# Altium project Ikea Environmental Sensor.PrjPcb
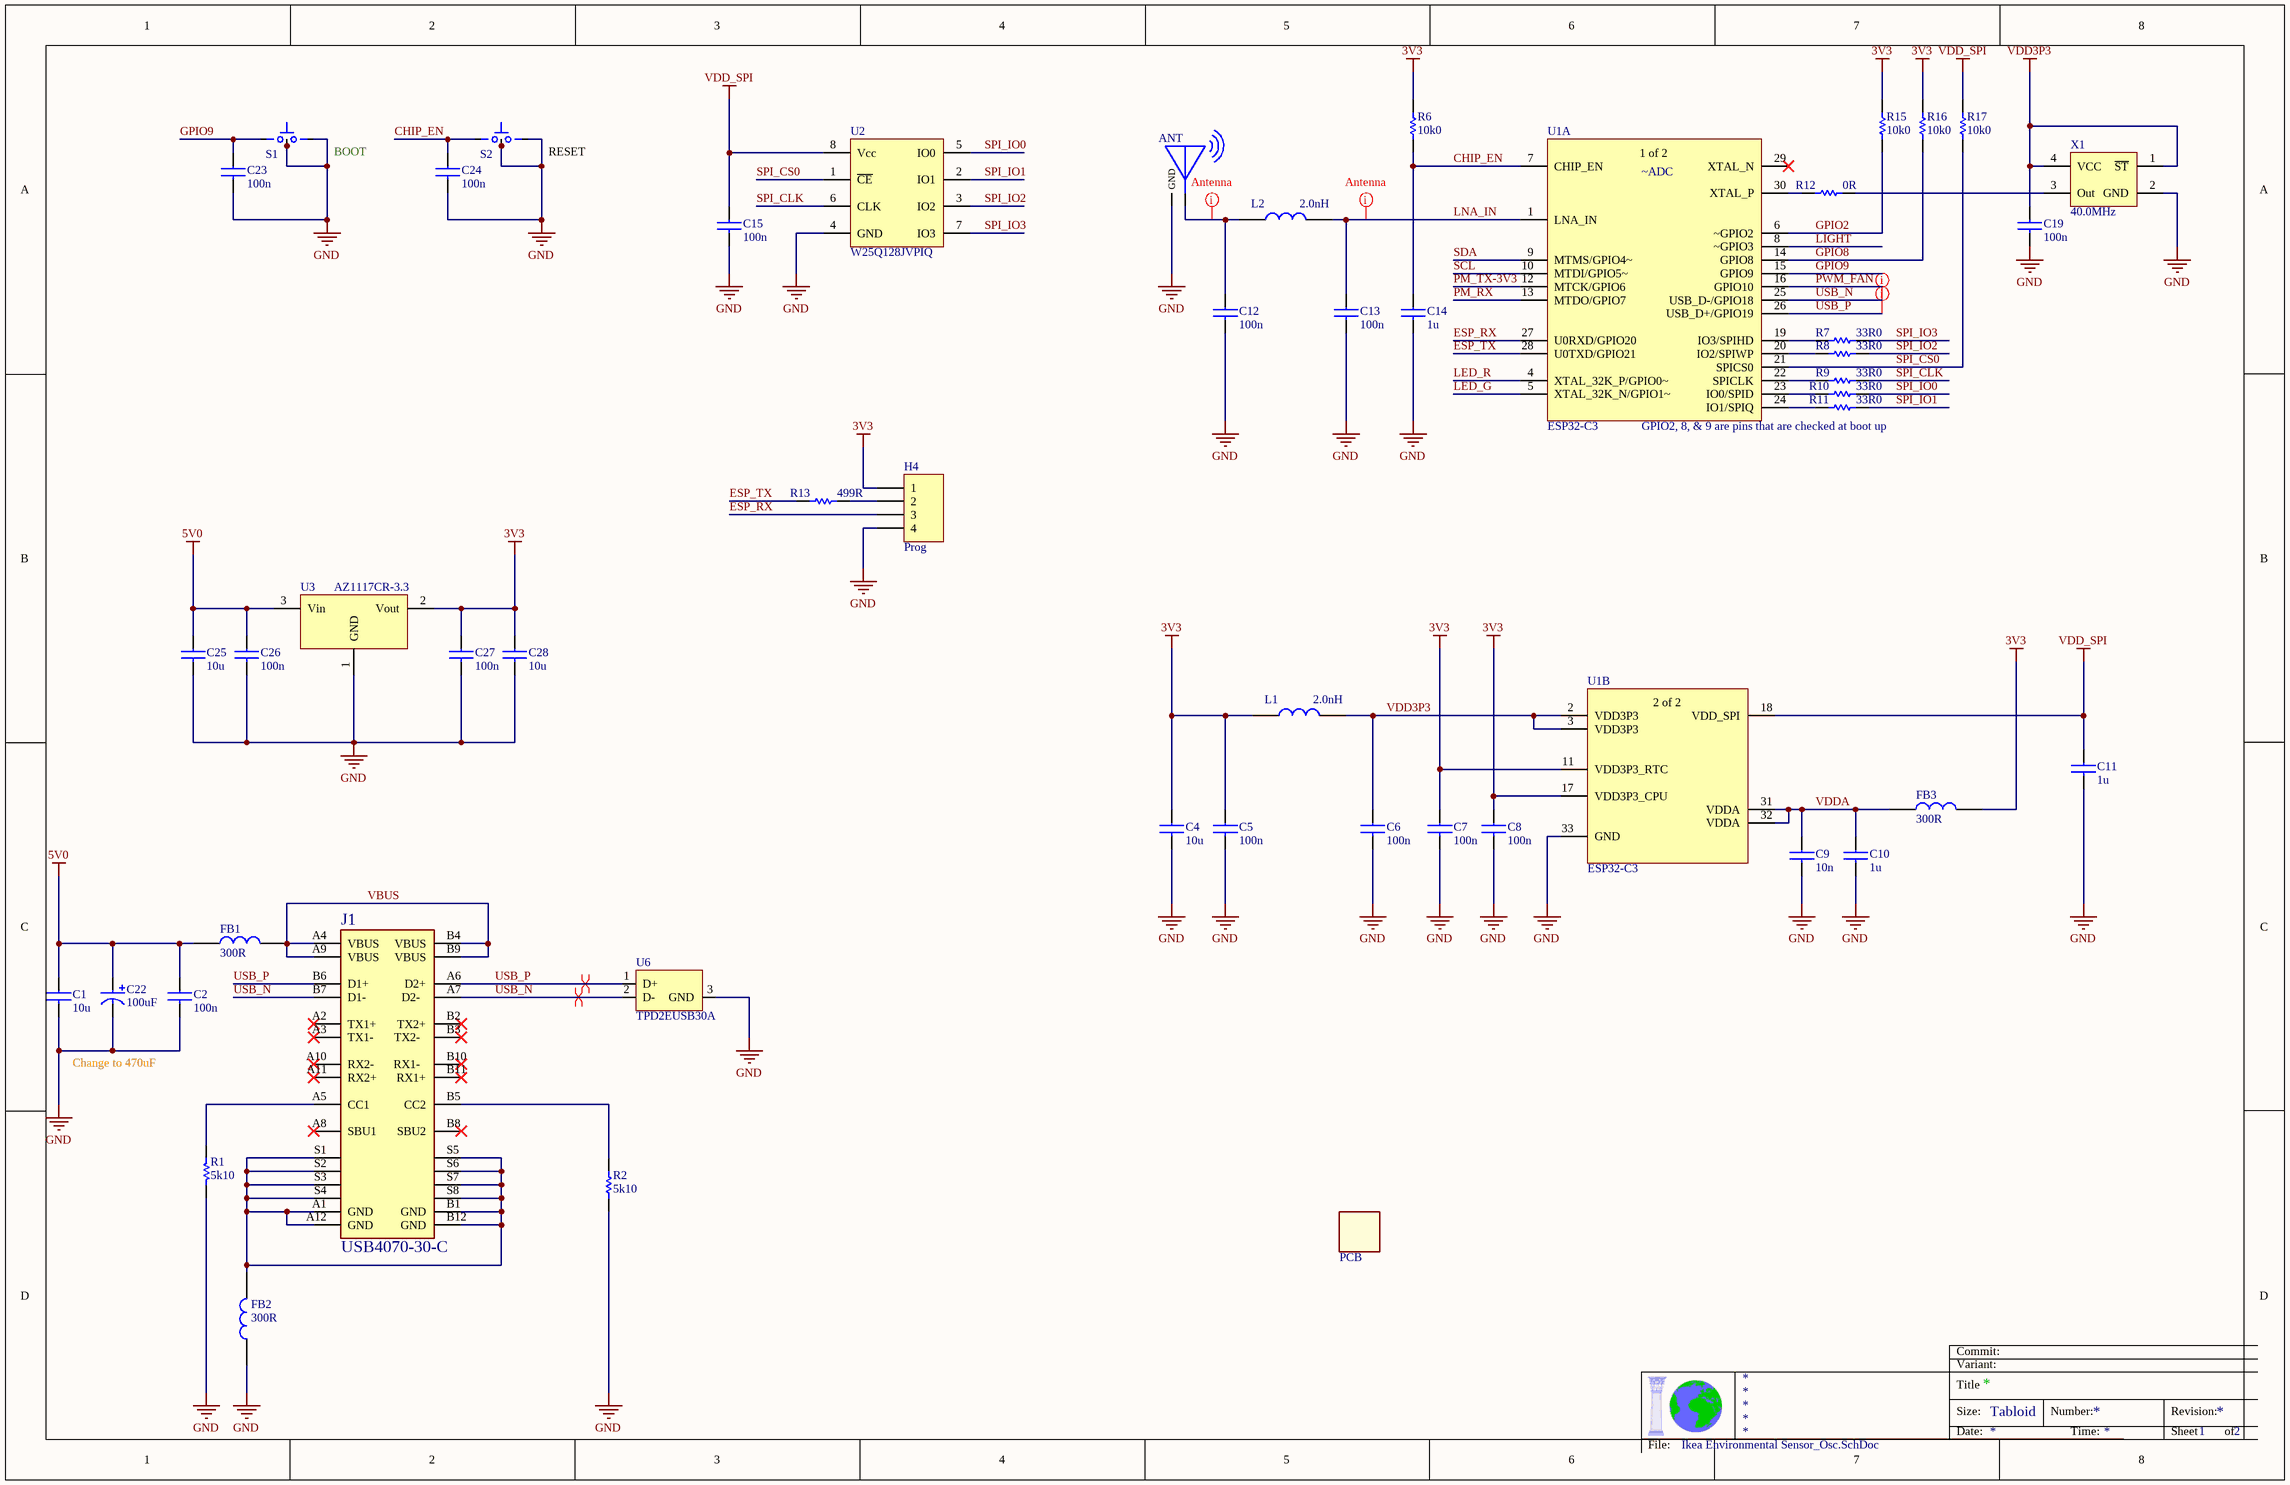
[diagram p0: Ikea Environmental Sensor_Osc.SchDoc]
CAGE_CODE: ?????; CONTRACT_NUMBER: <CONTRACT NO>; DOC_NO_ASSY_DWG: <ASSY DWG NO>; DOC_NO_BOM: <BOM DOC NO>; DOC_NO_FAB_DWG: <FAB DWG NO>; DOC_NO_SCH_DWG: <SCH DWG NO>; PCB_2_DEC_TOL: +/-.01; PCB_3_DEC_TOL: +/-.010; PCB_ANG_TOL: +/-1/2; PCB_ASSEMBLY_NO: <PCB ASSY NO>; PCB_CHECKER: GCI; PCB_CHECKER_APP_DATE: --/--/----; PCB_DESIGNER: GCI; PCB_DESIGNER_APP_DATE: --/--/----; PCB_DWG_NO: <PCB DWG NO>; PCB_ENGINEER: GCI; PCB_ENGINEER_APP_DATE: --/--/----; PCB_PART_NUMBER: <PCB PN>; PCB_REV: A; RevisionNumber: 1.0; SCH_REV: A
2 sheets, 88 parts. Net scope: global (net labels, ports and power ports of the same name join across sheets).
Board file: Ikea Environmental Sensor_Osc.PcbDoc
Sheets:
  Ikea Environmental Sensor_Osc.SchDoc
  Ikea Environmental Sensors.SchDoc

## Sheet Ikea Environmental Sensor_Osc.SchDoc
size Tabloid; SheetNumber: 1; SheetTotal: 2; ENG_APP_DATE: --/--/--; DSN_APP_DATE: --/--/--; CHK_APP_DATE: --/--/--

### Parts
ANT  PCB Antenna  [MINI-ANT-TYPED-H - Flipped]  (value not drawn)  (net tie, no BOM)
C1  10u  [0603X90]
C2  100n  [C_0402_N]
C4  10u  [0603X90]
C5  100n  [C_0402_N]
C6  100n  [C_0402_N]
C7  100n  [C_0402_N]
C8  100n  [C_0402_N]
C9  10n  [C_0402_N]
C10  1u  [C_0402_N]
C11  1u  [C_0402_N]
C12  100n  [C_0201]
C13  100n  [C_0201]
C14  1u  [C_0402_N]
C15  100n  [C_0402_N]
C19  100n  [C_0201]
C22  value 100uF  [CAP_6.6x6.6]  (hidden comment: 100uF, 35V)
C23  100n  [C_0402_N]
C24  100n  [C_0402_N]
C25  10u  [0603X90]
C26  100n  [C_0402_N]
C27  100n  [C_0402_N]
C28  10u  [0603X90]
FB1  300R  [FB_0402-NIC]
FB2  300R  [FB_0402-NIC]
FB3  300R  [FB_0402-NIC]
H4  Prog  [HDR1X4]
J1  USB4070-30-C  [USB_C_GCT_USB4070-30-C_REVC5]
L1  2.0nH  [FB_0402-NIC]
L2  2.0nH  [L_0201]
PCB?  PCB  [LOGO-GIO]
R1  5k10  [R_0402-N]
R2  5k10  [R_0402-N]
R6  10k0  [R_0402-N]
R7  33R0  [R_0402-N]
R8  33R0  [R_0402-N]
R9  33R0  [R_0402-N]
R10  33R0  [R_0402-N]
R11  33R0  [R_0402-N]
R12  0R  [R_0402-N]
R13  499R  [R_0402-N]
R15  10k0  [R_0402-N]
R16  10k0  [R_0402-N]
R17  10k0  [R_0402-N]
S1  BOOT  [SW_122514]
S2  RESET  [SW_122514]
U1  ESP32-C3  [QFN-32_5x5]  (parts A,B of 2)
U2  W25Q128JVPIQ  [WSON_8]
U3  AZ1117CR-3.3  [SOT89-150P410X160-3N]
U6  TPD2EUSB30A  [DRT3]
X1  40.0MHz  [XTAL_2.0mmx1.6mm]

### Nets
3V3: C4.1 C5.1 C7.1 C8.1 C27.1 C28.1 FB3.2 H4.1 L1.1 R6.2 R15.2 R16.2 U1.11(VDD3P3_RTC) U1.17(VDD3P3_CPU) U3.2(Vout)
5V0: C1.1 C2.1 C22.1 C25.1 C26.1 FB1.1 U3.3(Vin)
GND: ANT.2(GND) C1.2 C2.2 C4.2 C5.2 C6.2 C7.2 C8.2 C9.2 C10.2 C11.2 C12.2 C13.2 C14.2 C15.2 C19.2 C22.2 C23.2 C24.2 C25.2 C26.2 C27.2 C28.2 FB2.1 H4.4 R1.1 R2.1 S1.2(B) S1.3 S1.4 S2.2(B) S2.3 S2.4 U1.33(GND) U2.4(GND) U3.1(GND) U6.3(GND) X1.2(GND)
VDD3P3: C6.1 C19.1 L1.2 U1.2(VDD3P3) U1.3(VDD3P3) X1.1(~{ST}) X1.4(VCC)
VDD_SPI: C11.1 C15.1 R17.2 U1.18(VDD_SPI) U2.8(Vcc)
CHIP_EN: C14.1 C24.1 R6.1 S2.1(A) U1.7(CHIP_EN)
ESP_RX: H4.3 U1.27(U0RXD/GPIO20)
ESP_TX: R13.1 U1.28(U0TXD/GPIO21)
GPIO2: R15.1 U1.6(~GPIO2)
GPIO8: R16.1 U1.14(GPIO8)
GPIO9: C23.1 S1.1(A) U1.15(GPIO9)
LED_G: U1.5(XTAL_32K_N/GPIO1~)
LED_R: U1.4(XTAL_32K_P/GPIO0~)
LIGHT: U1.8(~GPIO3)
LNA_IN: C13.1 L2.2 U1.1(LNA_IN)
PM_RX: U1.13(MTDO/GPIO7)
PM_TX-3V3: U1.12(MTCK/GPIO6)
PWM_FAN: U1.16(GPIO10)
SCL: U1.10(MTDI/GPIO5~)
SDA: U1.9(MTMS/GPIO4~)
SPI_CLK: R9.2 U2.6(CLK)
SPI_CS0: R17.1 U1.21(SPICS0) U2.1(~{CE})
SPI_IO0: R10.2 U2.5(IO0)
SPI_IO1: R11.2 U2.2(IO1)
SPI_IO2: R8.2 U2.3(IO2)
SPI_IO3: R7.2 U2.7(IO3)
USB_N: J1.A7(D2-) J1.B7(D1-) U1.25(USB_D-/GPIO18) U6.2(D-)
USB_P: J1.A6(D2+) J1.B6(D1+) U1.26(USB_D+/GPIO19) U6.1(D+)
VBUS: FB1.2 J1.A4(VBUS) J1.A9(VBUS) J1.B4(VBUS) J1.B9(VBUS)
VDDA: C9.1 C10.1 FB3.1 U1.31(VDDA) U1.32(VDDA)
NetANT_1: ANT.1 C12.1 L2.1
NetFB2_2: FB2.2 J1.A1(GND) J1.A12(GND) J1.B1(GND) J1.B12(GND) J1.S1(Shield) J1.S2(Shield) J1.S3(Shield) J1.S4(Shield) J1.S5(Shield) J1.S6(Shield) J1.S7(Shield) J1.S8(Shield)
NetH4_2: H4.2 R13.2
NetJ1_A5: J1.A5(CC1) R1.2
NetJ1_B5: J1.B5(CC2) R2.2
NetR7_1: R7.1 U1.19(IO3/SPIHD)
NetR8_1: R8.1 U1.20(IO2/SPIWP)
NetR9_1: R9.1 U1.22(SPICLK)
NetR10_1: R10.1 U1.23(IO0/SPID)
NetR11_1: R11.1 U1.24(IO1/SPIQ)
NetR12_1: R12.1 U1.30(XTAL_P)
NetR12_2: R12.2 X1.3(Out)

Not connected (* = marked no-connect by the designer): J1 A2(TX1+)* A3(TX1-)* A8(SBU1)* A10(RX2-)* A11(RX2+)* B2(TX2+)* B3(TX2-)* B8(SBU2)* B10(RX1-)* B11(RX1+)*; U1 29(XTAL_N)*

### Layout directives
differential pair: USB_N, USB_P
net class Antenna: LNA_IN, NetANT_1
net class USB: USB_N, USB_P

### Notes on the sheet
- GPIO2, 8, & 9 are pins that are checked at boot up
- Change to 470uF
- Variant:
- Commit:
- Title
- Size:
- Date:
- Tabloid
- Number:
- Time:
- Revision:
- Sheet
- of
- File:
- (in symbol U_ESP32-C3_QFN32, part A) 1 of 2; ~ADC
- (in symbol U_ESP32-C3_QFN32, part B) 2 of 2

### Library data of the parts
ANT = Antenna_PCB_MIFA: Antenna MIFA 2.4Gig; Manufacturer: Rainsun; Man_Part_Number: AN9520-245; Value: Chip Antenna; Vendor: LCSC; LCSC_Part_Number: C99665
C1 C4 C25 C28 = C_10u_10V_10_0603_NIC: Cap, Chip, 10uF, 10V, ± 15%, X5R, 0603; Manufacturer: NIC; Manufacturer_No: NMC0603X5R106K10TRPF; Dist_No: NMC0603X5R106K10TRPF; Distributor: NIC; HelpURL: http://www.niccomp.com/catalog/nmc1.pdf; Price: 0.02; IOT: IOT-0719; JLCPCB Part #: C96446; Supplier 1: Verical; Supplier Part Number 1: NMC0603X5R106K10TRPF
C2 C5-C8 C15 C23 C24 C26 C27 = C_100n_16V_10_0402_NIC: Cap, Chip, 100nF, 16V, +/-10%, X7R, 0402; Manufacturer: NIC; Manufacturer_No: NMC0402X7R104K16TRPF; HelpURL: http://www.niccomp.com/catalog/nmc3.pdf; IOT: IOT-0301; Supplier 1: Future Electronics; Supplier Part Number 1: NMC0402X7R104K16TRPF-REEL
C9 = C_10n_25V_20_0402_NIC: Cap, Chip, 0.01uF, 25V, 20%, X7R, 0402; Manufacturer: NIC; Manufacturer_No: NMC0402X7R103K25TRP; HelpURL: http://www.niccomp.com/catalog/nmc2.pdf; IOT: IOT-0057; Supplier 1: Future Electronics; Supplier Part Number 1: NMC0402X7R103K25TRPF-REEL
C10 C11 C14 = C_1u_10V_10_0402_NIC: Cap, Chip, 1uF, 10V, 10%, X5R, 0402; Manufacturer: NIC; Manufacturer_No: NMC0402X5R105K10TRPF; IOT: IOT-; Dist_No: NMC0402X5R105K10TRPF; Distributor: Avnet; HelpURL: http://www.niccomp.com/catalog/nmc2.pdf; Price: 0.0056; Supplier 1: Future Electronics; Supplier Part Number 1: NMC0402X5R105K10TRPF-CUTT
C12 C13 C19 = C_100n_25V_10_0201_Murata: Cap, Chip, 100nF, 25V, +/-10%, X5R, 0201; Manufacturer: Murata; Manufacturer_No: GRM033R61E104KE14J; Dist_No: Arrow; IOT: IOT-; Distributor: GRM033R61E104KE14J; HelpURL: https://search.murata.co.jp/Ceramy/image/img/A01X/G101/ENG/GRM033R61E104KE14-01.pdf; Supplier 1: Arrow Electronics; Supplier Part Number 1: GRM033R61E104KE14J; ComponentLink1Description: Datasheet; ComponentLink1URL: https://search.murata.co.jp/Ceramy/image/img/A01X/G101/ENG/GRM033R61E104KE14-01.pdf
C22 = C_100uF_35V_20_6.6mm_Panasonic: Cap AlEl, 100uF, 35V, 20%, 6.6mm dia.; Manufacturer_No: EEE-FK1V101XP; Manufacturer: Panasonic; IOT: IOT-0525; Distributor: Avnet; HelpURL: http://industrial.panasonic.com/www-cgi/jvcr13pz.cgi?E+PZ+3+ABA0120+EEEFK1V101XP+7+WW; Price: 0.1320; Supplier 1: Digi-Key; Supplier Part Number 1: PCE3836CT-ND
FB1-FB3 = FB_300R_0402_NIC: Ferrite bead,300 ohm@100MHz,0.15 ohm @DC, 1A, 0402; Manufacturer: NIC; Manufacturer_No: NCB-H0402P301TR100F; Distributor: NIC; Price: 0.01; HelpURL: http://www.niccomp.com/catalog/ncbh.pdf; Dist_No: NCB-H0402P301TR100F; Value: 300R; IOT: IOT-0720; Supplier 1: Digi-Key; Supplier Part Number 1: 490-5256-2-ND
H4 = Header 4: Header, 4-Pin
J1 = J_USB_C_REC_SMT_V: CONN RCPT USB 3.1 Type C Vertical SMT; Manufacturer: GCT; IOT: IOT-; Manufacturer_No: USB4070-30-C; Distributor: Future; Dist_No: USB4070-30-C; Price: 2.4; HelpURL: https://gct.co/files/drawings/usb4070.pdf?v=898ffa4a-86c9-4e61-8d6e-9ea790d66fc5#page=1; ComponentLink1Description: Datasheet; ComponentLink1URL: https://gct.co/files/drawings/usb4070.pdf?v=898ffa4a-86c9-4e61-8d6e-9ea790d66fc5#page=1; Supplier 1: Future Electronics; Supplier Part Number 1: 8074232; JLCPCB Part #: C168703
L1 = L_2nH_LQG15HS2N0S02D_0402: Inductor 2.0nH, +/-0.3nH, LQG15HS2N0S02D, 0402; Manufacturer: Murata; IOT: IOT-; Value: 2.0nH; Manufacturer_No: LQG15HS2N0S02D; Distributor: Avnet; Dist_No: LQG15HS2N0S02D; Datasheet: https://search.murata.co.jp/Ceramy/image/img/P02/JELF243B-0010.pdf; Price: .2597; Supplier 1: Arrow Electronics; Supplier Part Number 1: LQG15HN4N7S02D; JLCPCB Part #: C880712
L2 = L_2nH_LQP03TN2N0B02D_0201: Inductor 2.0nH, +/-0.1nH, 600mA, 0201; Manufacturer: Murata; IOT: IOT-; Value: 2.0nH; Manufacturer_No: LQP03TN2N0B02D; Distributor: Arrow; Dist_No: LQP03TN2N0B02D; Datasheet: https://search.murata.co.jp/Ceramy/image/img/P02/JELF243C-0015.pdf; Price: .2597; Supplier 1: Arrow Electronics; Supplier Part Number 1: LQP03TN2N0B02D
PCB? = PCB: Ikea Environmental 4-Layer PCB; Manufacturer: IO Technologies; Manufacturer_No: *
R1 R2 = R_5k10_60mW_1_0402_NIC: Resistor, 5.10 kΩ, 1%, 0.06W, 0402; Manufacturer_No: NRC04F5101TRF; Manufacturer: NIC; Value: 5.10k; HelpURL: http://www.niccomp.com/catalog/nrc.pdf; Supplier 1: Arrow Electronics; Supplier Part Number 1: NRC04F5101TRF; JLCPCB Part #: C25905
R6 R15-R17 = R_10k0_60mW_1_0402_NIC: Resistor, 10.0 kΩ, 1%, 0.06W, 0402; Manufacturer_No: NRC04F1002TRF; Manufacturer: NIC; Value: 10k; HelpURL: http://www.niccomp.com/catalog/nrc.pdf; IOT: IOT-0100; JLCPCB Part #: C25744; Supplier 1: Arrow Electronics; Supplier Part Number 1: NRC04F1002TRF
R7-R11 = R_33R0_60mW_1_0402_NIC: Resistor, 33.0 Ω, 1%, 0.06W, 0402; Manufacturer_No: NRC04F33R0TRF; Manufacturer: NIC; Value: 33; HelpURL: http://www.niccomp.com/catalog/nrc.pdf; IOT: IOT-0090; JLCPCB Part #: C25161; Supplier 1: Arrow Electronics; Supplier Part Number 1: NRC04F33R0TRF
R12 = R_0R00_60mW_1_0402_NIC: Resistor, 0 Ω, 1%, 0.06W, 0402; Manufacturer_No: NRC04ZOTRF; Manufacturer: NIC; HelpURL: http://www.niccomp.com/catalog/nrc.pdf; IOT: IOT-0087; Value: 0R; Supplier 1: Arrow Electronics; Supplier Part Number 1: NRC04ZOTRF
R13 = R_499R_60mW_1_0402_NIC: Resistor, 499 Ω, 1%, 0.06W, 0402; Manufacturer_No: NRC04F4990TRF; Manufacturer: NIC; IOT: IOT-; Value: 499; Distributor: NIC; Dist_No: NRC04F4990TRF; HelpURL: http://www.niccomp.com/catalog/nrc.pdf; Supplier 1: Arrow Electronics; Supplier Part Number 1: NRC04F4990TRF; JLCPCB Part #: C137970
S1 S2 = SW_Side Actuated Button R/A: Side Actuated Button R/A; Manufacturer: HYP; Manufacturer_No: 1TS002G-2300-3500-CT; Dist_No: C319377; Value: Button R/A; Distributor: LCSC; JLCPCB Part #: C319377; ComponentLink1Description: Datasheet; ComponentLink1URL: https://datasheet.lcsc.com/lcsc/1811070920_HYP--Hongyuan-Precision-1TS002G-2300-3500-CT_C319377.pdf; Supplier 1: LCSC; Supplier Part Number 1: C319377
U1 = U_ESP32-C3_QFN32: IC, ESP32-C3, 160MHz RISC-V Single Core, QFN32; Manufacturer: Espressif Systems; Manufacturer_No: ESP32-C3; ComponentLink1Description: Datasheet; ComponentLink1URL: https://www.espressif.com/sites/default/files/documentation/esp32-c3_datasheet_en.pdf#page=21; JLCPCB Part #: C2838500; Supplier 1: Digi-Key; Supplier Part Number 1: 1904-ESP32-C3CT-ND
U2 = U_W25Q128JVPIQ_WSON8: IC, Flash Memory 128Mb (16Mkx8), 3.3V, WSON8-5x6; Manufacturer: Winbond; Distributor: Arrow; Dist_No: W25Q128JVPIQ; HelpURL: http://www.winbond.com/resource-files/w25q16jv%20spi%20revg%2003222018%20plus.pdf; Manufacturer_No: W25Q128JVPIQ; Price: 0.35; ComponentLink1Description: Datasheet; ComponentLink1URL: https://www.winbond.com/resource-files/W25Q128JV%20RevH%2003102021%20Plus.pdf; Supplier 1: Arrow Electronics; Supplier Part Number 1: W25Q128JVPIQ; JLCPCB Part #: C2803379
U3 = U_AZ1117CR-3.3TRG1_SOT89-3: IC, CONV DC/DC LDO 3.3V, 15V In 1A, SOT89-3; Manufacturer: Diodes Inc; IOT: IOT-; Distributor: Arrow; Dist_No: AZ1117CR-3.3TRG1; HelpURL: https://www.diodes.com/assets/Datasheets/AZ1117C.pdf#page=14; Manufacturer_No: AZ1117CR-3.3TRG1; Price: 0.15; Supplier 1: Verical; Supplier Part Number 1: AZ1117CR-3.3TRG1; JLCPCB Part #: C347256
U6 = U_TPD2EUSB30A-SOT_DRT-3: 2 Channel ESD for USB 3.0; Manufacturer: Texas Instruments; Manufacturer_No: TPD2EUSB30ADRTR; Datasheet: http://www.ti.com/lit/gpn/tpd2eusb30a; Distributor: Avnet; HelpURL: http://www.ti.com/lit/gpn/tpd2eusb30a; IOT: IOT-0557; Price: 0.1641; Supplier 1: Digi-Key; Supplier Part Number 1: 296-28153-2-ND; JLCPCB Part #: C94934
X1 = OSC_40.0MHZ_3.3V_2.0x1.6: OSC, 40.00 MHZ 3.3V 20PPM SMD, 2.0x1.6; Manufacturer: ECS; Dist_No: ECS-TXO-2016-33-400-TR; IOT: IOT-; Distributor: Arrow; HelpURL: https://ecsxtal.com/store/pdf/ECS-TXO-2016.pdf; Manufacturer_No: ECS-TXO-2016-33-400-TR; Price: 0.70; ComponentLink1Description: Datasheet; ComponentLink1URL: https://ecsxtal.com/store/pdf/ECS-TXO-2016.pdf; Supplier 1: Arrow Electronics; Supplier Part Number 1: ECS-TXO-2016-33-400-TR; JLCPCB Part #: C213412

## Sheet Ikea Environmental Sensors.SchDoc
size Tabloid; SheetNumber: 2; SheetTotal: 2; ENG_APP_DATE: --/--/--; DSN_APP_DATE: --/--/--; CHK_APP_DATE: --/--/--
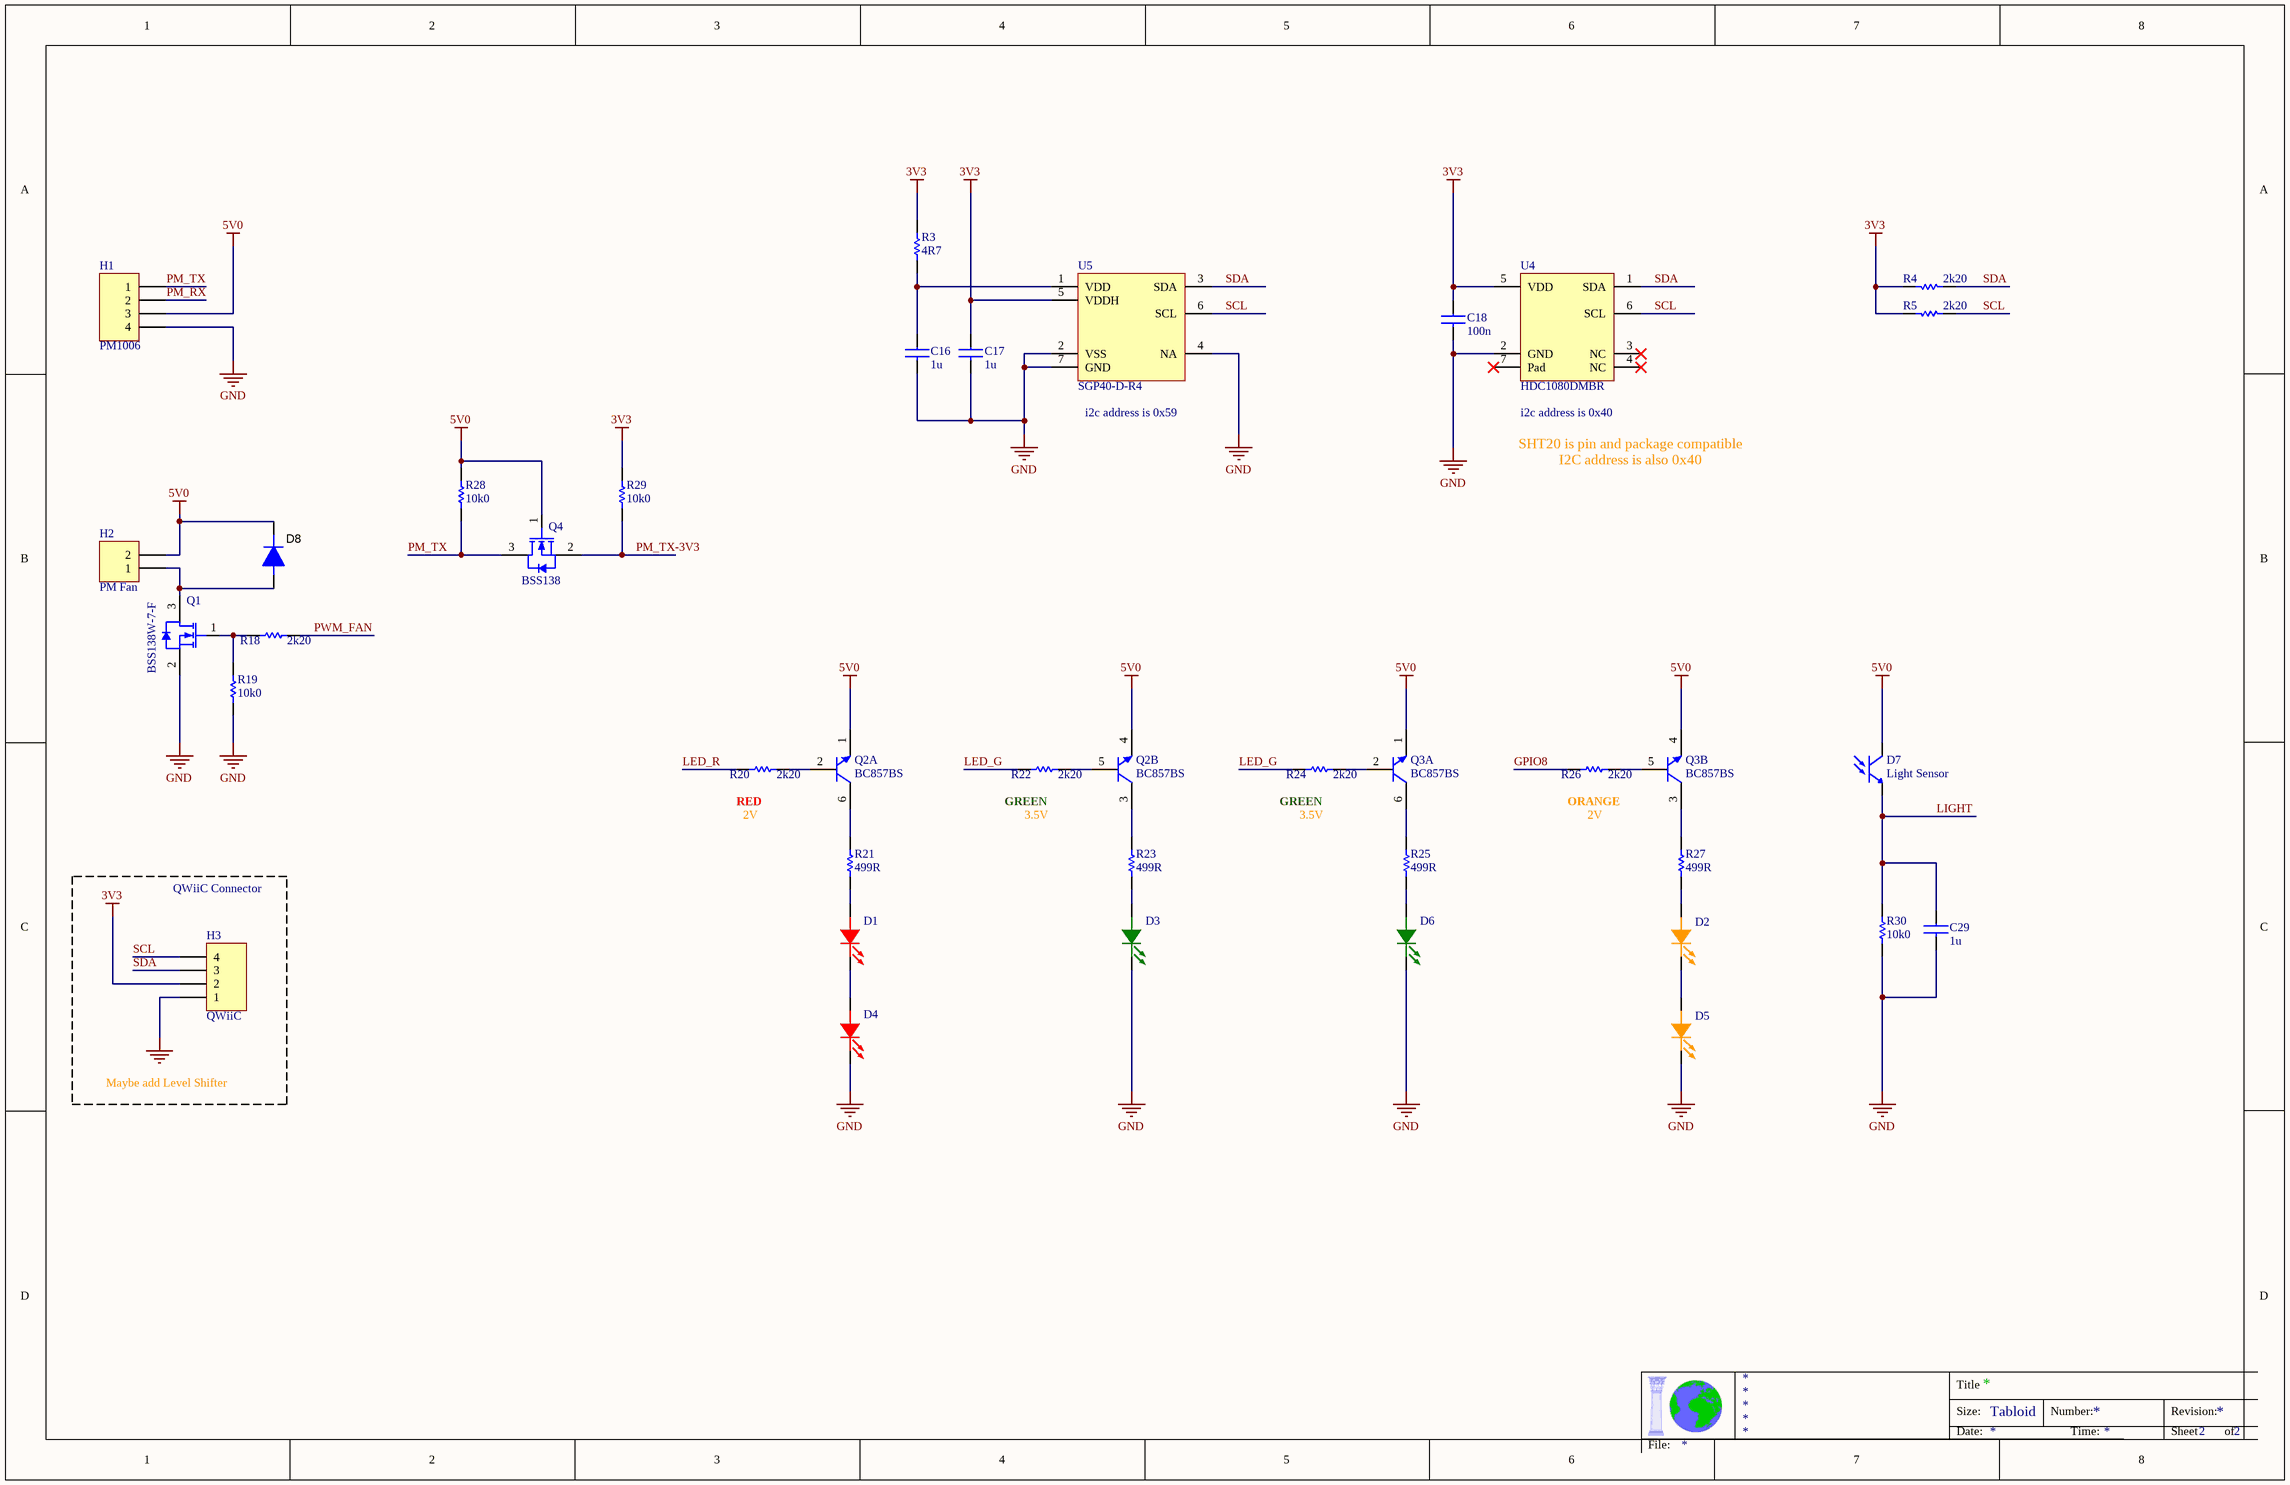
[diagram p1: Ikea Environmental Sensors.SchDoc]

### Parts
C16  1u  [C_0402_N]
C17  1u  [C_0402_N]
C18  100n  [C_0402_N]
C29  1u  [C_0402_N]
D1  0603 Red  [D_0603]  (value not drawn)
D2  0603 Orange  [D_0603]  (value not drawn)
D3  0603 Green  [D_0603]  (value not drawn)
D4  0603 Red  [D_0603]  (value not drawn)
D5  0603 Orange  [D_0603]  (value not drawn)
D6  0603 Green  [D_0603]  (value not drawn)
D7  Light Sensor  [XDCR_ALS-PT19-315C/L177/TR8]
D8  1N4148  [SOD-523]  (value not drawn)
H1  PM1006  [HDR1x4_1.5mm_RA_TH]
H2  PM Fan  [HDR1x2_1.25mm_RA_TH]
H3  QWiiC  [JST SM04B-SRSS-TB]
Q1  BSS138W-7-F  [SOT323]
Q2  BC857BS  [SOT363_N]  (parts A,B of 2)
Q3  BC857BS  [SOT363_N]  (parts A,B of 2)
Q4  BSS138  [SOT323]
R3  4R7  [R_0402-N]
R4  2k20  [R_0402-N]
R5  2k20  [R_0402-N]
R18  2k20  [R_0402-N]
R19  10k0  [R_0402-N]
R20  2k20  [R_0402-N]
R21  499R  [R_0402-N]
R22  2k20  [R_0402-N]
R23  499R  [R_0402-N]
R24  2k20  [R_0402-N]
R25  499R  [R_0402-N]
R26  2k20  [R_0402-N]
R27  499R  [R_0402-N]
R28  10k0  [R_0402-N]
R29  10k0  [R_0402-N]
R30  10k0  [R_0402-N]
U4  HDC1080DMBR  [DMB0006A]
U5  SGP40-D-R4  [SGP40_SEN-M]

### Nets
3V3: C17.1 C18.1 H3.2 R3.2 R4.1 R5.1 R29.2 U4.5(VDD) U5.5(VDDH)
5V0: D7.1(ANODE) D8.2(K) H1.3 H2.2 Q2.1(E) Q2.4(E) Q3.1(E) Q3.4(E) Q4.1(G) R28.2
GND: C16.2 C17.2 C18.2 C29.2 D3.2(CATHODE) D4.2(CATHODE) D5.2(CATHODE) D6.2(CATHODE) H1.4 H3.1 Q1.2(S) R19.1 R30.1 U4.2(GND) U5.2(VSS) U5.4(NA) U5.7(GND)
GPIO8: R26.2
LED_G: R22.2 R24.2
LED_R: R20.2
LIGHT: C29.1 D7.2(CATHODE) R30.2
PM_RX: H1.2
PM_TX: H1.1 Q4.3(D) R28.1
PM_TX-3V3: Q4.2(S) R29.1
PWM_FAN: R18.1
SCL: H3.4 R5.2 U4.6(SCL) U5.6(SCL)
SDA: H3.3 R4.2 U4.1(SDA) U5.3(SDA)
NetC16_1: C16.1 R3.1 U5.1(VDD)
NetD1_1: D1.1(ANODE) R21.1
NetD1_2: D1.2(CATHODE) D4.1(ANODE)
NetD2_1: D2.1(ANODE) R27.1
NetD2_2: D2.2(CATHODE) D5.1(ANODE)
NetD3_1: D3.1(ANODE) R23.1
NetD6_1: D6.1(ANODE) R25.1
NetD8_1: D8.1(A) H2.1 Q1.3(D)
NetQ1_1: Q1.1(G) R18.2 R19.2
NetQ2_2: Q2.2(B) R20.1
NetQ2_3: Q2.3(C) R23.2
NetQ2_5: Q2.5(B) R22.1
NetQ2_6: Q2.6(C) R21.2
NetQ3_2: Q3.2(B) R24.1
NetQ3_3: Q3.3(C) R27.2
NetQ3_5: Q3.5(B) R26.1
NetQ3_6: Q3.6(C) R25.2

Not connected (* = marked no-connect by the designer): U4 3(NC)* 4(NC)* 7(Pad)*

### Notes on the sheet
- (near U5) i2c address is 0x59
- (near U4) i2c address is 0x40
- SHT20 is pin and package compatible
  I2C address is also 0x40
- (near R20) RED
- (near R20) 2V
- (near R22) GREEN
- (near R22) 3.5V
- (near R24) GREEN
- (near R24) 3.5V
- (near R26) ORANGE
- (near R26) 2V
- QWiiC Connector
- Maybe add Level Shifter
- Title
- Size:
- Date:
- Tabloid
- Number:
- Time:
- Revision:
- Sheet
- of
- File:

### Library data of the parts
C16 C17 C29 = C_1u_10V_10_0402_NIC: as C10 on sheet Ikea Environmental Sensor_Osc; Dist_No: NMC0402X5R105K10TRPF; Distributor: Avnet; HelpURL: http://www.niccomp.com/catalog/nmc2.pdf; Price: 0.0056; Supplier 1: Future Electronics; Supplier Part Number 1: NMC0402X5R105K10TRPF-CUTT
C18 = C_100n_16V_10_0402_NIC: as C2 on sheet Ikea Environmental Sensor_Osc; HelpURL: http://www.niccomp.com/catalog/nmc3.pdf; IOT: IOT-0301; Supplier 1: Future Electronics; Supplier Part Number 1: NMC0402X7R104K16TRPF-REEL
D1 D4 = D_LED-0603_LTST-C190KRKT: 0603 LED, Red, Vf=1.6-2.4V; Manufacturer: Lite-on; Distributor: Arrow; Dist_No: LTST-C190KRKT; Manufacturer_No: LTST-C190KRKT; HelpURL: http://optoelectronics.liteon.com/upload/download/DS-22-99-0151/LTST-C190KRKT.pdf; Price: 0.0376; IOT: IOT-0708; Supplier 1: Arrow Electronics; Supplier Part Number 1: LTST-C190KRKT; JLCPCB Part #: C84256; ComponentLink1Description: Datasheet; ComponentLink1URL: http://optoelectronics.liteon.com/upload/download/DS-22-99-0151/LTST-C190KRKT.pdf
D2 D5 = D_LED-0603_LTST-C190KFKT: 0603 LED, Orange, Vf=2.0-2.4V; Manufacturer: Lite-on; IOT: IOT-; Supplier 1: Arrow Electronics; Supplier Part Number 1: LTST-C190KFKT; Manufacturer_No: LTST-C190KFKT; Distributor: Arrow; HelpURL: https://optoelectronics.liteon.com/upload/download/DS-22-99-0186/LTST-C190KFKT.PDF; Price: 0.0376; Dist_No: LTST-C190KFKT; ComponentLink1Description: Datasheet; ComponentLink1URL: https://optoelectronics.liteon.com/upload/download/DS-22-99-0186/LTST-C190KFKT.PDF; JLCPCB Part #: C146215
D3 D6 = D_LED-0603_LTST-C190KGKT: 0603 LED, Green, Vf=1.9-2.4V; Manufacturer: Lite-on; Distributor: Arrow; Dist_No: LTST-C190KGKT; Manufacturer_No: LTST-C190KGKT; HelpURL: http://optoelectronics.liteon.com/upload/download/DS22-2000-074/S_110_LTST-C190KGKT.pdf; Price: 0.0376; IOT: IOT-0171; Supplier 1: Digi-Key; Supplier Part Number 1: 160-1435-1-ND; JLCPCB Part #: C72043; ComponentLink1Description: Datasheet; ComponentLink1URL: http://optoelectronics.liteon.com/upload/download/DS22-2000-074/S_110_LTST-C190KGKT.pdf
D7 = Q_Photodiode_ALS-PT19_2-SMD: Sensor, Photo, 630NM, 2-SMD; Manufacturer: Lite-on; Dist_No: ALS-PT19-315C/L177/TR8; IOT: IOT-; Distributor: Avnet; Manufacturer_No: ALS-PT19-315C/L177/TR8; HelpURL: https://everlighteurope.com/index.php?controller=attachment&id_attachment=5170; Price: 0.0376; Supplier 1: Digi-Key; Supplier Part Number 1: 1080-1244-1-ND; ComponentLink1Description: Datasheet; ComponentLink1URL: https://everlighteurope.com/index.php?controller=attachment&id_attachment=5170; JLCPCB Part #: C146233
D8 = D_1N4148WT_SOD523: Diode, Signal, 300-mA, 75-V, 350-mW, SOD523; Manufacturer: NextGeb; IOT: IOT-; Value: 1N4148WT; Manufacturer_No: 1N4148WT; Dist_No: 1N4148WT; Distributor: Arrow; HelpURL: https://media.digikey.com/pdf/Data%20Sheets/NextGen%20Components%20PDFs/SOD523148WTST4.pdf; Price: 0.0119; ComponentLink1Description: Datasheet; ComponentLink1URL: https://media.digikey.com/pdf/Data%20Sheets/NextGen%20Components%20PDFs/SOD523148WTST4.pdf; Supplier 1: Arrow Electronics; Supplier Part Number 1: 1N4148WT-7; JLCPCB Part #: C511874
H1 = Header 4_RA_1.5mm_TH: Header, 4-Pin; Manufacturer: JST; Manufacturer_No: S4B-ZR; Supplier 1: Verical; Supplier Part Number 1: S4B-ZR-SM4A-TF; JLCPCB Part #: C225169; ComponentLink1Description: Datasheet; ComponentLink1URL: https://www.jst-mfg.com/product/pdf/eng/eZH.pdf?61639681cff8b
H2 = Header 2_1.25_TH: Header, 2-Pin; ComponentLink1Description: Datasheet-Vertical; ComponentLink1URL: https://www.molex.com/pdm_docs/sd/530470210_sd.pdf; ComponentLink2Description: Datasheet-RA; ComponentLink2URL: https://www.molex.com/pdm_docs/sd/530480210_sd.pdf
H3 = Header 4_RA_1.00mm_SMT: Header, 4-Pin; Manufacturer: JST; Manufacturer_No: SM04B-SRSS-TB(LF)(SN); IOT: IOT-; Supplier 1: Digi-Key; Supplier Part Number 1: 455-1804-1-ND; JLCPCB Part #: C145956
Q1 = Q_N-CH_50V_A200_BSS138W_SOT323: MOSFET N-Channel 50V, 200mA, 200mW, SOT323; Manufacturer: Diodes Inc.; Manufacturer_No: BSS138W -7-F; Distributor: Avnet; Dist_No: BSS138W -7-F; HelpURL: http://www.diodes.com/datasheets/ds30206.pdf; Price: 0.23; IOT: IOT-0233; Supplier 1: Digi-Key; Supplier Part Number 1: BSS138W-FDITR-ND
Q2 Q3 = Q_BC857BS,115_SOT363: PNP GP Double Transistor, 45V,100mA, SOT363; Manufacturer: NXP; Manufacturer_No: BC857BS,115; Dist_No: BC857BS,115; Distributor: Arrow; HelpURL: https://assets.nexperia.com/documents/data-sheet/BC857BS.pdf; Price: 0.12000; ComponentLink1Description: Datasheet; ComponentLink1URL: https://assets.nexperia.com/documents/data-sheet/BC857BS.pdf; JLCPCB Part #: C8654; Supplier 1: Future Electronics; Supplier Part Number 1: 4266805
Q4 = Q_N-CH_50V_A200_BSS138W_SOT323: MOSFET N-Channel 50V, 200mA, 200mW, SOT323; Manufacturer_No: BSS138W -7-F; Manufacturer: Diodes Inc.; Distributor: Avnet; Dist_No: BSS138W -7-F; HelpURL: http://www.diodes.com/datasheets/ds30206.pdf; Price: 0.23; IOT: IOT-0233; Supplier 1: Digi-Key; Supplier Part Number 1: BSS138W-FDITR-ND
R3 = R_4R7_60mW_1_0402_NIC: Resistor, 4.7 Ω, 1%, 0.06W, 0402; Manufacturer_No: NRC04F4R70TRF; Manufacturer: NIC; IOT: IOT-; Distributor: NIC; Dist_No: NRC04F4R70TRF; HelpURL: http://www.niccomp.com/catalog/nrc.pdf; Value: 4R7; Supplier 1: Arrow Electronics; Supplier Part Number 1: NRC04F4R70TRF
R4 R5 R18 R20 R22 R24 R26 = R_2k20_60mW_1_0402_NIC: Resistor, 2.20 kΩ, 1%, 0.06W, 0402; Manufacturer_No: NRC04F2201TRF; Manufacturer: NIC; Value: 2.2k; HelpURL: http://www.niccomp.com/catalog/nrc.pdf; IOT: IOT-0099; Supplier 1: Arrow Electronics; Supplier Part Number 1: NRC04F2201TRF
R19 R28-R30 = R_10k0_60mW_1_0402_NIC: as R6 on sheet Ikea Environmental Sensor_Osc; HelpURL: http://www.niccomp.com/catalog/nrc.pdf; IOT: IOT-0100
R21 R23 R25 R27 = R_499R_60mW_1_0402_NIC: as R13 on sheet Ikea Environmental Sensor_Osc; Distributor: NIC; Dist_No: NRC04F4990TRF; HelpURL: http://www.niccomp.com/catalog/nrc.pdf; Supplier 1: Arrow Electronics; Supplier Part Number 1: NRC04F4990TRF
U4 = U_HDC1080DMBR_DFN6: IC, Digital Temp & Humidity Sensor, DFN6; Manufacturer: Texas Instruments; Distributor: Arrow; Dist_No: HDC1080DMBR; HelpURL: https://www.ti.com/lit/ds/symlink/hdc1080.pdf; Manufacturer_No: HDC1080DMBR; Price: 2.20; IOT: *; JLCPCB Part #: C82227; ComponentLink1Description: Datasheet; ComponentLink1URL: https://www.ti.com/lit/ds/symlink/hdc1080.pdf; Supplier 1: LCSC; Supplier Part Number 1: C82227
U5 = U_SGP40-D-R4_DFN6: IC, Air Quality Gas Sensor, DFN6; Manufacturer: Sensirion; Manufacturer_No: SGP40-D-R4; ComponentLink1Description: Datasheet; ComponentLink1URL: https://media.digikey.com/pdf/Data%20Sheets/Sensirion%20PDFs/Sensirion_Gas_Sensors_Datasheet_SGP40.pdf#page=16; Supplier 1: Verical; Supplier Part Number 1: SGP40-D-R4

## Nets that join several sheets
3V3: Ikea Environmental Sensor_Osc (15 pins), Ikea Environmental Sensors (9 pins)
5V0: Ikea Environmental Sensor_Osc (7 pins), Ikea Environmental Sensors (10 pins)
GND: Ikea Environmental Sensor_Osc (38 pins), Ikea Environmental Sensors (17 pins)
GPIO8: Ikea Environmental Sensor_Osc (R16.1 U1.14), Ikea Environmental Sensors (R26.2)
LED_G: Ikea Environmental Sensor_Osc (U1.5), Ikea Environmental Sensors (R22.2 R24.2)
LED_R: Ikea Environmental Sensor_Osc (U1.4), Ikea Environmental Sensors (R20.2)
LIGHT: Ikea Environmental Sensor_Osc (U1.8), Ikea Environmental Sensors (C29.1 D7.2 R30.2)
PM_RX: Ikea Environmental Sensor_Osc (U1.13), Ikea Environmental Sensors (H1.2)
PM_TX-3V3: Ikea Environmental Sensor_Osc (U1.12), Ikea Environmental Sensors (Q4.2 R29.1)
PWM_FAN: Ikea Environmental Sensor_Osc (U1.16), Ikea Environmental Sensors (R18.1)
SCL: Ikea Environmental Sensor_Osc (U1.10), Ikea Environmental Sensors (H3.4 R5.2 U4.6 U5.6)
SDA: Ikea Environmental Sensor_Osc (U1.9), Ikea Environmental Sensors (H3.3 R4.2 U4.1 U5.3)

## Assembly variants
Prototype: not fitted H4